# Altium schematic sheet FPGA_DDR3_Interface.SchDoc
size A3; SheetNumber: 9; SheetTotal: 9
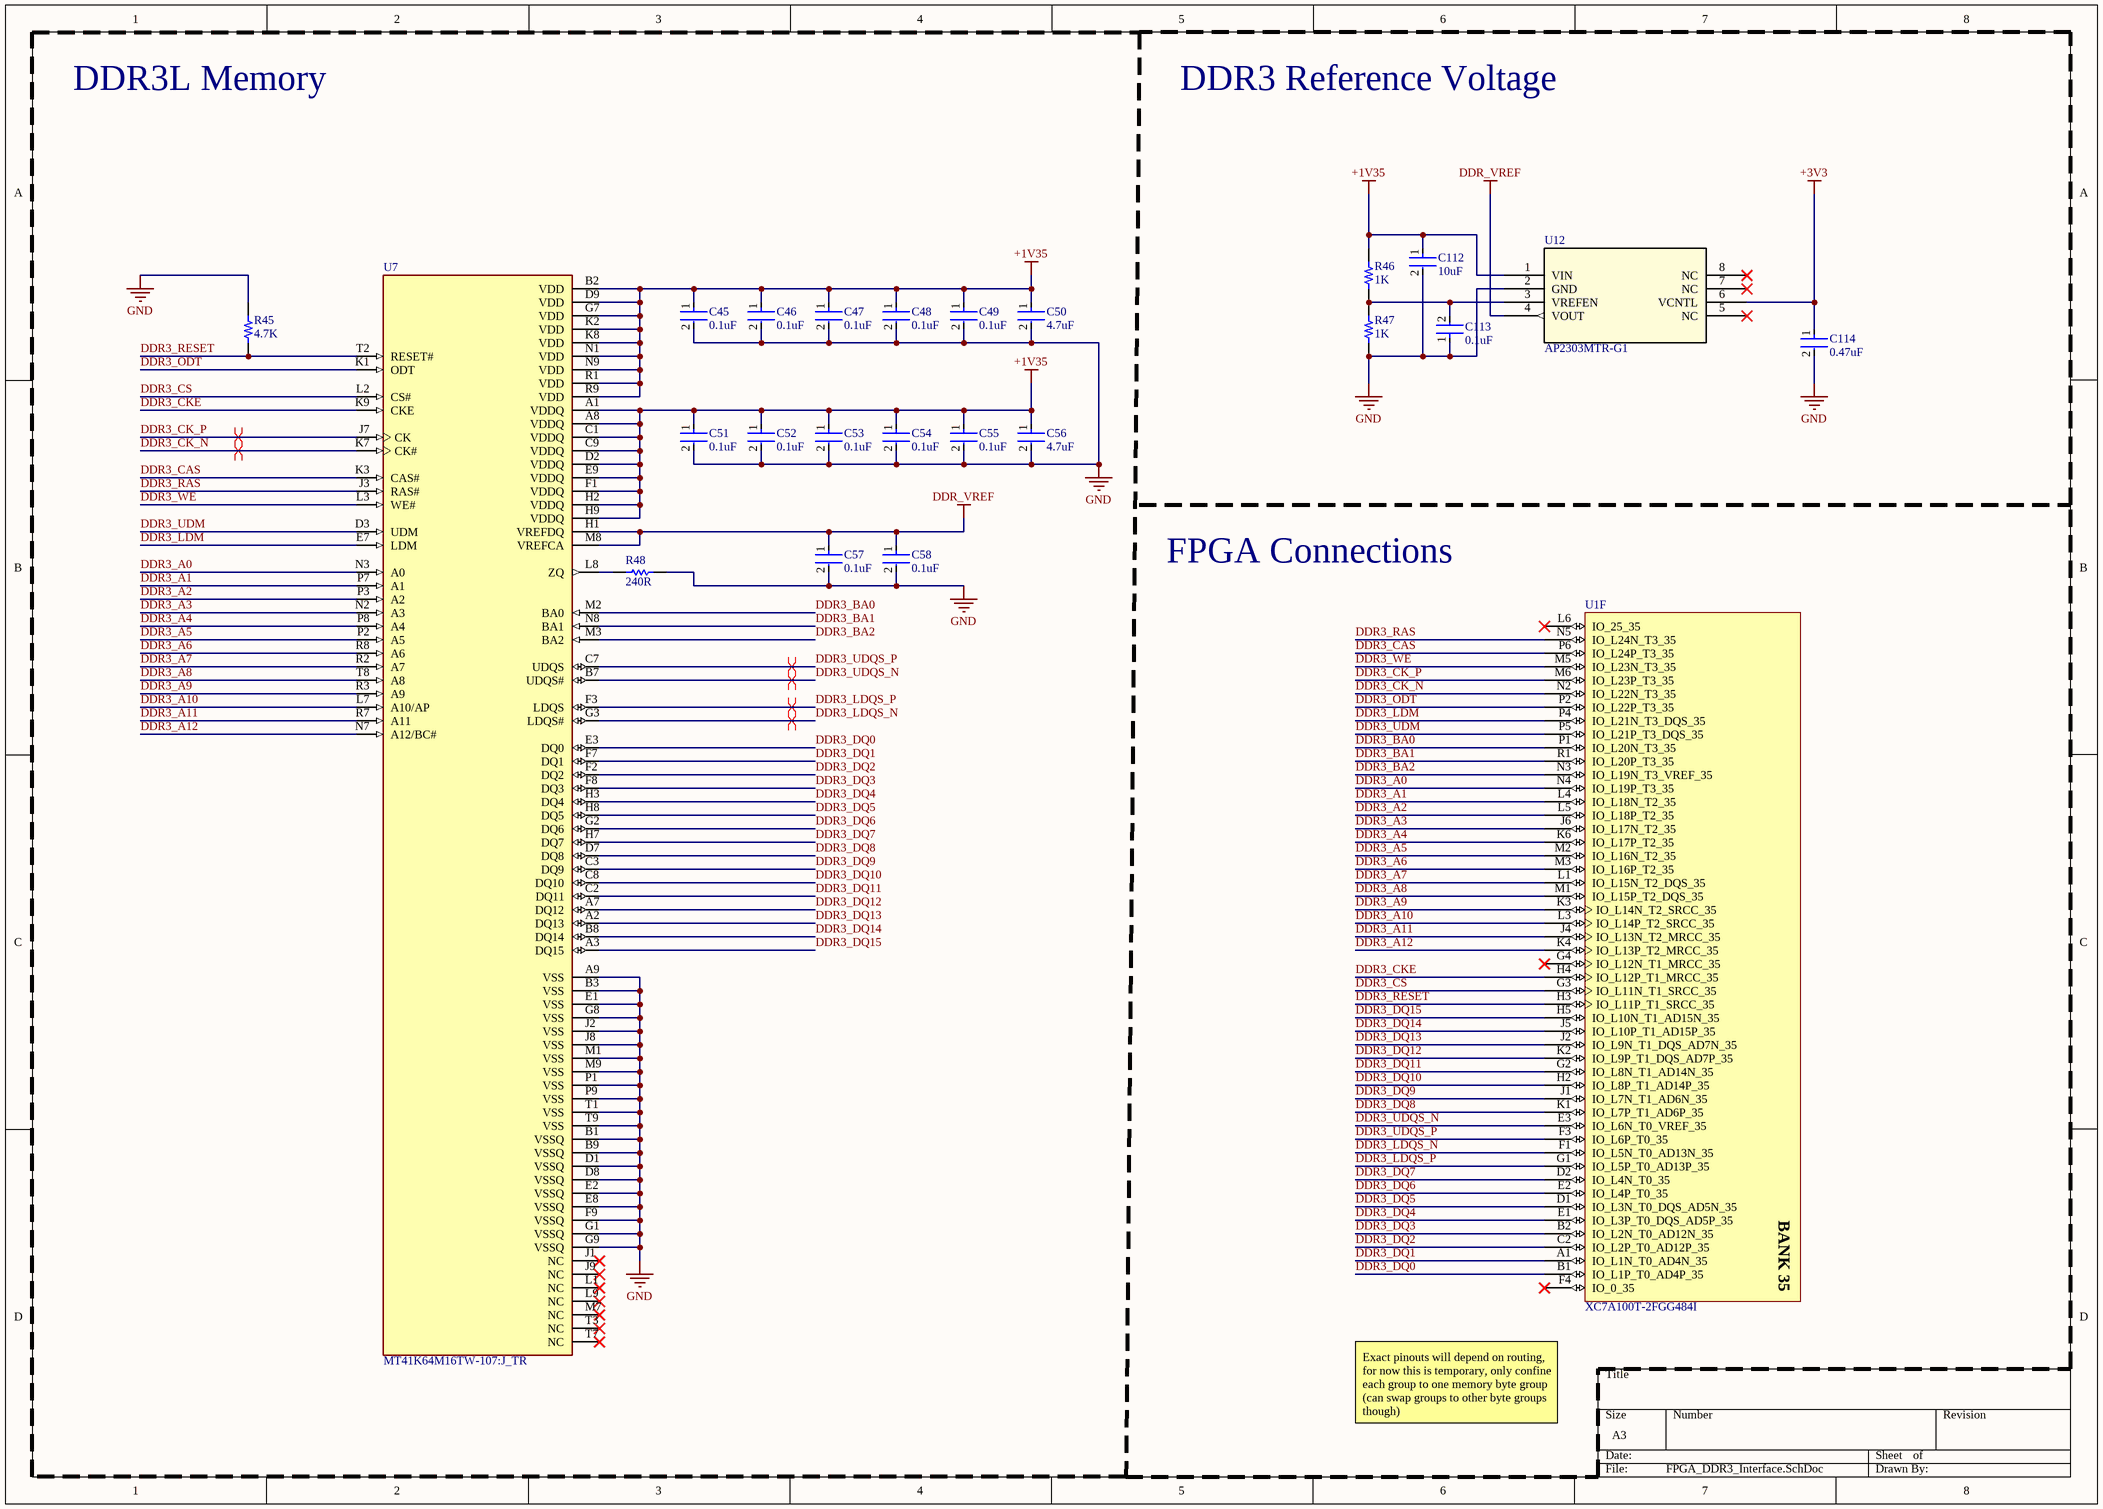
[diagram p0: FPGA_DDR3_Interface.SchDoc]

## Parts
C45  0.1uF  [FP-CC0402-MFG]
C46  0.1uF  [FP-CC0402-MFG]
C47  0.1uF  [FP-CC0402-MFG]
C48  0.1uF  [FP-CC0402-MFG]
C49  0.1uF  [FP-CC0402-MFG]
C50  4.7uF  [FP-CC0402-MFG]
C51  0.1uF  [FP-CC0402-MFG]
C52  0.1uF  [FP-CC0402-MFG]
C53  0.1uF  [FP-CC0402-MFG]
C54  0.1uF  [FP-CC0402-MFG]
C55  0.1uF  [FP-CC0402-MFG]
C56  4.7uF  [FP-CC0402-MFG]
C57  0.1uF  [FP-CC0402-MFG]
C58  0.1uF  [FP-CC0402-MFG]
C112  10uF  [FP-GRM155-0_2-IPC_C]
C113  0.1uF  [FP-CC0402-MFG]
C114  0.47uF  [FP-GRM188-0_1-e0_2_0_5-MFG]
R45  4.7K  [RES 0603_1608]
R46  1K  [RES 0603_1608]
R47  1K  [RES 0603_1608]
R48  240R  [RESC0402(1005)_L]
U1  XC7A100T-2FGG484I  [FGG484]  (part F of 10)
U7  MT41K64M16TW-107:J_TR  [BGA96C80P9X16_1400X800X120N]
U12  AP2303MTR-G1  [SOIC-8_AP2303MTR-G1_DIO-M]

## Blocks framed on the sheet
DDR3L Memory: C45-C58 R45 R48 U7

## Nets
+1V35: C45.1 C46.1 C47.1 C48.1 C49.1 C50.1 C51.1 C52.1 C53.1 C54.1 C55.1 C56.1 C112.1 R46.1 U7.A1(VDDQ) U7.A8(VDDQ) U7.B2(VDD) U7.C1(VDDQ) U7.C9(VDDQ) U7.D2(VDDQ) U7.D9(VDD) U7.E9(VDDQ) U7.F1(VDDQ) U7.G7(VDD) U7.H2(VDDQ) U7.H9(VDDQ) U7.K2(VDD) U7.K8(VDD) U7.N1(VDD) U7.N9(VDD) U7.R1(VDD) U7.R9(VDD) U12.1(VIN)
+3V3: C114.1 U12.6(VCNTL)
DDR_VREF: C57.1 C58.1 U7.H1(VREFDQ) U7.M8(VREFCA) U12.4(VOUT)
GND: C45.2 C46.2 C47.2 C48.2 C49.2 C50.2 C51.2 C52.2 C53.2 C54.2 C55.2 C56.2 C57.2 C58.2 C112.2 C113.1 C114.2 R45.2 R47.2 R48.1 U7.A9(VSS) U7.B1(VSSQ) U7.B3(VSS) U7.B9(VSSQ) U7.D1(VSSQ) U7.D8(VSSQ) U7.E1(VSS) U7.E2(VSSQ) U7.E8(VSSQ) U7.F9(VSSQ) U7.G1(VSSQ) U7.G8(VSS) U7.G9(VSSQ) U7.J2(VSS) U7.J8(VSS) U7.M1(VSS) U7.M9(VSS) U7.P1(VSS) U7.P9(VSS) U7.T1(VSS) U7.T9(VSS) U12.2(GND)
DDR3_A0: U1.N4(IO_L19P_T3_35) U7.N3(A0)
DDR3_A1: U1.L4(IO_L18N_T2_35) U7.P7(A1)
DDR3_A2: U1.L5(IO_L18P_T2_35) U7.P3(A2)
DDR3_A3: U1.J6(IO_L17N_T2_35) U7.N2(A3)
DDR3_A4: U1.K6(IO_L17P_T2_35) U7.P8(A4)
DDR3_A5: U1.M2(IO_L16N_T2_35) U7.P2(A5)
DDR3_A6: U1.M3(IO_L16P_T2_35) U7.R8(A6)
DDR3_A7: U1.L1(IO_L15N_T2_DQS_35) U7.R2(A7)
DDR3_A8: U1.M1(IO_L15P_T2_DQS_35) U7.T8(A8)
DDR3_A9: U1.K3(IO_L14N_T2_SRCC_35) U7.R3(A9)
DDR3_A10: U1.L3(IO_L14P_T2_SRCC_35) U7.L7(A10/AP)
DDR3_A11: U1.J4(IO_L13N_T2_MRCC_35) U7.R7(A11)
DDR3_A12: U1.K4(IO_L13P_T2_MRCC_35) U7.N7(A12/BC#)
DDR3_BA0: U1.P1(IO_L20N_T3_35) U7.M2(BA0)
DDR3_BA1: U1.R1(IO_L20P_T3_35) U7.N8(BA1)
DDR3_BA2: U1.N3(IO_L19N_T3_VREF_35) U7.M3(BA2)
DDR3_CAS: U1.P6(IO_L24P_T3_35) U7.K3(CAS#)
DDR3_CK_N: U1.N2(IO_L22N_T3_35) U7.K7(CK#)
DDR3_CK_P: U1.M6(IO_L23P_T3_35) U7.J7(CK)
DDR3_CKE: U1.H4(IO_L12P_T1_MRCC_35) U7.K9(CKE)
DDR3_CS: U1.G3(IO_L11N_T1_SRCC_35) U7.L2(CS#)
DDR3_DQ0: U1.B1(IO_L1P_T0_AD4P_35) U7.E3(DQ0)
DDR3_DQ1: U1.A1(IO_L1N_T0_AD4N_35) U7.F7(DQ1)
DDR3_DQ2: U1.C2(IO_L2P_T0_AD12P_35) U7.F2(DQ2)
DDR3_DQ3: U1.B2(IO_L2N_T0_AD12N_35) U7.F8(DQ3)
DDR3_DQ4: U1.E1(IO_L3P_T0_DQS_AD5P_35) U7.H3(DQ4)
DDR3_DQ5: U1.D1(IO_L3N_T0_DQS_AD5N_35) U7.H8(DQ5)
DDR3_DQ6: U1.E2(IO_L4P_T0_35) U7.G2(DQ6)
DDR3_DQ7: U1.D2(IO_L4N_T0_35) U7.H7(DQ7)
DDR3_DQ8: U1.K1(IO_L7P_T1_AD6P_35) U7.D7(DQ8)
DDR3_DQ9: U1.J1(IO_L7N_T1_AD6N_35) U7.C3(DQ9)
DDR3_DQ10: U1.H2(IO_L8P_T1_AD14P_35) U7.C8(DQ10)
DDR3_DQ11: U1.G2(IO_L8N_T1_AD14N_35) U7.C2(DQ11)
DDR3_DQ12: U1.K2(IO_L9P_T1_DQS_AD7P_35) U7.A7(DQ12)
DDR3_DQ13: U1.J2(IO_L9N_T1_DQS_AD7N_35) U7.A2(DQ13)
DDR3_DQ14: U1.J5(IO_L10P_T1_AD15P_35) U7.B8(DQ14)
DDR3_DQ15: U1.H5(IO_L10N_T1_AD15N_35) U7.A3(DQ15)
DDR3_LDM: U1.P4(IO_L21N_T3_DQS_35) U7.E7(LDM)
DDR3_LDQS_N: U1.F1(IO_L5N_T0_AD13N_35) U7.G3(LDQS#)
DDR3_LDQS_P: U1.G1(IO_L5P_T0_AD13P_35) U7.F3(LDQS)
DDR3_ODT: U1.P2(IO_L22P_T3_35) U7.K1(ODT)
DDR3_RAS: U1.N5(IO_L24N_T3_35) U7.J3(RAS#)
DDR3_RESET: R45.1 U1.H3(IO_L11P_T1_SRCC_35) U7.T2(RESET#)
DDR3_UDM: U1.P5(IO_L21P_T3_DQS_35) U7.D3(UDM)
DDR3_UDQS_N: U1.E3(IO_L6N_T0_VREF_35) U7.B7(UDQS#)
DDR3_UDQS_P: U1.F3(IO_L6P_T0_35) U7.C7(UDQS)
DDR3_WE: U1.M5(IO_L23N_T3_35) U7.L3(WE#)
NetC113_2: C113.2 R46.2 R47.1 U12.3(VREFEN)
NetR48_2: R48.2 U7.L8(ZQ)

Not connected (* = marked no-connect by the designer): U1 F4(IO_0_35)* G4(IO_L12N_T1_MRCC_35)* L6(IO_25_35)*; U7 J1(NC)* J9(NC)* L1(NC)* L9(NC)* M7(NC)* T3(NC)* T7(NC)*; U12 5(NC)* 7(NC)* 8(NC)*

## Layout directives
differential pair: DDR3_CK_N, DDR3_CK_P, DDR3_LDQS_N, DDR3_LDQS_P, DDR3_UDQS_N, DDR3_UDQS_P

## Notes on the sheet
- DDR3 Reference Voltage
- FPGA Connections
- Exact pinouts will depend on routing, for now this is temporary, only confine each group to one memory byte group (can swap groups to other byte groups though)
- (in symbol CMP-0364-00030-3, part F) BANK 35

## Library data of the parts
C45-C49 C51-C55 C57 C58 C113 = CMP-03422-000048-1: CAP CER 0.1UF 16V X7R 0402; Manufacturer: YAGEO; Manufacturer Part Number: CC0402KRX7R7BB104; Material: Ceramic; Automotive Grade: NA; Capacitance: 100 nF; Temperature Coefficient: 30ppm/°C; Tolerance: 0.1; Value: 100 nF; Device Class L1: Passive Components; Temperature Range Low: -55°C; Device Class L3: Ceramic Capacitors; Temperature Characteristic: X7R; Ipc Land Pattern Name: CAPC10050X50; Temperature Range High: +125°C; Voltage Rating: 16 V; Temperature: -55°C to +125°C; RoHS: TRUE; Automotive: No; Height: 0.55mm; Device Class L2: Capacitors; Digikey Description: CAP CER 0.1UF 16V X7R 0402; Package: CC0402; Footprint Url: http://www.yageo.com/exep/pages/download/literatures/UPY-C_GEN_24.pdf; ComponentLink2Description: Datasheet; Category: Cap; Lead Free: Yes; Octopart: https://octopart.com/cc0402krx7r7bb104-yageo-42244624; ComponentLink2URL: http://www.yageo.com/documents/recent/UPY-GP_NP0_16V-to-50V_16.pdf; Mouser Description: 0402 0.1 uF 16 V ±10 % Tolerance X7R SMT Multilayer Ceramic Capacitor
C50 C56 = CMP-03422-001118-1: CAP CER 4.7UF 10V X5R 0402; Manufacturer Part Number: CC0402MRX5R6BB475; Manufacturer: YAGEO; Automotive Grade: NA; Tolerance: 0.2; Temperature Coefficient: 30ppm/°C; Material: Ceramic; ComponentLink2URL: http://www.yageo.com/documents/recent/UPY-GP_NP0_16V-to-50V_16.pdf; Temperature Range Low: -55°C; Digikey Description: CAP CER 4.7UF 10V X5R 0402; Category: Cap; Height: 0.55mm; Mouser Description: Multilayer Ceramic Capacitors MLCC - SMD/SMT 4.7M nF X5R 20% 10 Volts; ComponentLink2Description: Datasheet; Automotive: No; Octopart: https://octopart.com/cc0402mrx5r6bb475-yageo-57080755; Device Class L3: Ceramic Capacitors; Temperature Characteristic: X5R; Ipc Land Pattern Name: CAPC10050X50; Device Class L1: Passive Components; RoHS: TRUE; Device Class L2: Capacitors; Temperature Range High: +125°C; Voltage Rating: 10 V; Value: 4.7 uF; Footprint Url: http://www.yageo.com/exep/pages/download/literatures/UPY-C_GEN_24.pdf; Capacitance: 4.7 uF; Package: CC0402; Lead Free: Yes; Temperature: -55°C to +125°C
C112 = CMP-06035-044652-1: Chip Multilayer Ceramic Capacitors for General Purpose, 0402, 10uF, X5R, 15%, 20%, 6.3V
C114 = CMP-06035-003857-1: Chip Multilayer Ceramic Capacitors for General Purpose, 0603, 0.47uF, X7R, 15%, 10%, 25V; Capacitance: 470nF; Voltage: 50V; Case Code (Imperial): 0603; Mount: Surface Mount; Material: Ceramic; Case/Package: 0603; Thickness: 0.035inch; Tolerance: 10%; Length: 1.6mm; Lead Free: Lead Free; Voltage Rating: 25V; Width: 0.031inch; Voltage Rating (DC): 25V; Dielectric: X7R; Case Code (Metric): 1608; Number of Pins: 2; Termination: SMD/SMT; REACH SVHC: No SVHC; Min Operating Temperature: -55°C; Max Operating Temperature: 125°C; Depth: 0.8mm; Height: 0.8mm; Package Quantity: 4000; Packaging: Tape and Reel
R45 = CMP-010-0075-8: Fixed Resistor, Metal Glaze/thick Film, 0.1W, 4700ohm, 75V, 1% +/-Tol, 100ppm/Cel, Surface Mount, 0603; Temperature Coefficient: 100ppm/°C; Case/Package: 0603; Voltage Rating: 75V
R46 R47 = CMP-009-00014-17: 1 kOhms ±1% 0.1W, 1/10W Chip Resistor 0603 (1608 Metric) Moisture Resistant Thick Film; Temperature Coefficient: 100ppm/°C; Voltage Rating: 75V; Case/Package: 0603
R48 = CMP-1011-00438-1: 240R 0.063W 1% 0402 (1005 Metric)  SMD; Case-Metric: 1005; Case-EIA: 0402; Value: 240.00 Ohm; Power: 0.063 W; Tolerance: 1 %; Technology: SMT
U1 = CMP-0364-00030-3: Artix-7 FPGA, 285 User I/Os, 4 GTP, 484-Ball BGA, Speed Grade 2, Industrial Grade, Pb-Free; Manufacturer: Xilinx; DSP48E1 Slices: 240; Speed Grade: -2; Clock Mgmt Tiles (CMTs): 6; Block RAM Blocks (Max Kb): 4860; Max User I/O: 300; Block RAM Blocks (18Kb): 270; CLBs (Slices): 15850; Logic Cells: 101440; Block RAM Blocks (36Kb): 135; ComponentLink2URL: http://www.xilinx.com/support/documentation/user_guides/ug475_7Series_Pkg_Pinout.pdf; DatasheetVersion: v1.12; PartNumber: XC7A100T-2FGG484I; ComponentLink5Description: Packaging and Pinout; PackageDescription: Wire-Bond Fine-Pitch BGA, Body 23 x 23 mm, 1.0 mm Pitch; Mounting Technology: Surface Mount; ComponentLink1Description: Datasheet; ComponentLink4URL: http://www.xilinx.com/support/packagefiles/a7packages/xc7a100tfgg484pkg.txt; PackageVersion: Rev 1.8; NexusDeviceID: XC7A100T-2FGG484I; ComponentLink5URL: http://www.xilinx.com/support/documentation/user_guides/ug475_7Series_Pkg_Pinout.pdf; Code_JEDEC: MS-034-AAJ-1; Generic Part Number: XC7A100T; ComponentLink4Description: Package File; ComponentLink3Description: DC and Switching Characteristics; ComponentLink1URL: http://www.xilinx.com/support/documentation/data_sheets/ds180_7Series_Overview.pdf; CLBs (Max Distributed RAM Kb): 1188; ComponentLink2Description: Package Specification; RoHS: Pb-Free; ComponentLink3URL: http://www.xilinx.com/support/documentation/data_sheets/ds181_Artix_7_Data_Sheet.pdf; PackageReference: FGG484
U7 = MT41K64M16TW-107:J_TR: SDRAM - DDR3L Memory IC 1Gb (64M x 16) Parallel 933MHz 20ns 96-FBGA (8x14); MF: Micron Technology Inc.; MP: MT41K64M16TW-107:J TR; Package: None; Check_prices: https://www.snapeda.com/parts/MT41K64M16TW-107:J%20TR/Micron/view-part/5640273/?ref=eda; Price: None; SnapEDA_Link: https://www.snapeda.com/parts/MT41K64M16TW-107:J%20TR/Micron/view-part/5640273/?ref=snap; Value: *; Purchase-URL: https://pricing.snapeda.com/search/part/MT41K64M16TW-107:J TR/?ref=eda; Availability: Warning
U12 = AP2303MTR-G1: No Description Available; Mfr_Name: Diodes Inc; RefDes: RefDes; Type: Type